# Altium schematic sheet power.SchDoc
size A4
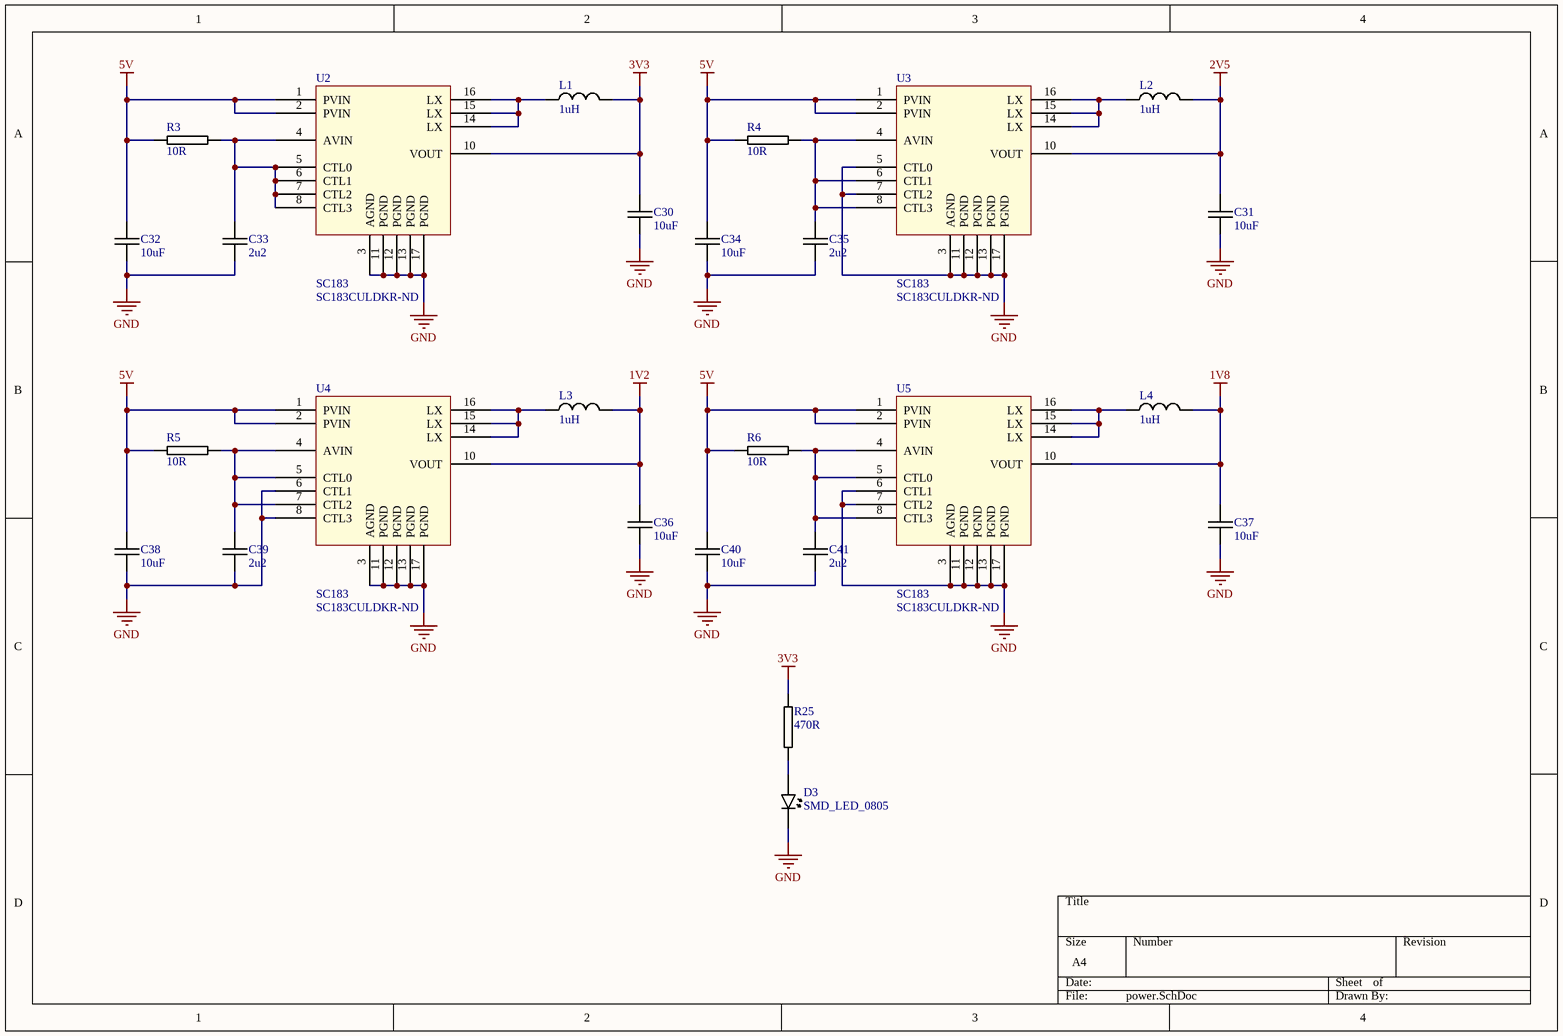
[diagram p0: power.SchDoc]

## Parts
C30  10uF  [0805C-GENERIC]
C31  10uF  [0805C-GENERIC]
C32  10uF  [0805C-GENERIC]
C33  2u2  [0805C-GENERIC]
C34  10uF  [0805C-GENERIC]
C35  2u2  [0805C-GENERIC]
C36  10uF  [0805C-GENERIC]
C37  10uF  [0805C-GENERIC]
C38  10uF  [0805C-GENERIC]
C39  2u2  [0805C-GENERIC]
C40  10uF  [0805C-GENERIC]
C41  2u2  [0805C-GENERIC]
D3  SMD_LED_0805  [CD2012-0805]
L1  1uH  [VISHAY-IHLP1616-GENERIC]
L2  1uH  [VISHAY-IHLP1616-GENERIC]
L3  1uH  [VISHAY-IHLP1616-GENERIC]
L4  1uH  [VISHAY-IHLP1616-GENERIC]
R3  10R  [0603R-10]
R4  10R  [0603R-10]
R5  10R  [0603R-10]
R6  10R  [0603R-10]
R25  470R  [0603R-470]
U2  SC183  Supplier Part Number 1: SC183CULDKR-ND  [QFN50P300X300-16V6N]
U3  SC183  Supplier Part Number 1: SC183CULDKR-ND  [QFN50P300X300-16V6N]
U4  SC183  Supplier Part Number 1: SC183CULDKR-ND  [QFN50P300X300-16V6N]
U5  SC183  Supplier Part Number 1: SC183CULDKR-ND  [QFN50P300X300-16V6N]

## Nets
1V2: C36.1 L3.2 U4.10(VOUT)
1V8: C37.1 L4.2 U5.10(VOUT)
2V5: C31.1 L2.2 U3.10(VOUT)
3V3: C30.1 L1.2 R25.1 U2.10(VOUT)
5V: C32.1 C34.1 C38.1 C40.1 R3.1 R4.1 R5.1 R6.1 U2.1(PVIN) U2.2(PVIN) U3.1(PVIN) U3.2(PVIN) U4.1(PVIN) U4.2(PVIN) U5.1(PVIN) U5.2(PVIN)
GND: C30.2 C31.2 C32.2 C33.2 C34.2 C35.2 C36.2 C37.2 C38.2 C39.2 C40.2 C41.2 D3.2(K) U2.3(AGND) U2.11(PGND) U2.12(PGND) U2.13(PGND) U2.17(PGND) U3.3(AGND) U3.5(CTL0) U3.7(CTL2) U3.11(PGND) U3.12(PGND) U3.13(PGND) U3.17(PGND) U4.3(AGND) U4.6(CTL1) U4.8(CTL3) U4.11(PGND) U4.12(PGND) U4.13(PGND) U4.17(PGND) U5.3(AGND) U5.6(CTL1) U5.7(CTL2) U5.11(PGND) U5.12(PGND) U5.13(PGND) U5.17(PGND)
NetC33_1: C33.1 R3.2 U2.4(AVIN) U2.5(CTL0) U2.6(CTL1) U2.7(CTL2) U2.8(CTL3)
NetC35_1: C35.1 R4.2 U3.4(AVIN) U3.6(CTL1) U3.8(CTL3)
NetC39_1: C39.1 R5.2 U4.4(AVIN) U4.5(CTL0) U4.7(CTL2)
NetC41_1: C41.1 R6.2 U5.4(AVIN) U5.5(CTL0) U5.8(CTL3)
NetD3_1: D3.1(A) R25.2
NetL1_1: L1.1 U2.14(LX) U2.15(LX) U2.16(LX)
NetL2_1: L2.1 U3.14(LX) U3.15(LX) U3.16(LX)
NetL3_1: L3.1 U4.14(LX) U4.15(LX) U4.16(LX)
NetL4_1: L4.1 U5.14(LX) U5.15(LX) U5.16(LX)

## Library data of the parts
C30-C32 C34 C36-C38 C40 = 0805C-10UF-16V-X5R-TDK: CAPACITOR 0805 CERAMIC; Manufacturer Part Number: C2012X5R1C106M; Manufacturer: TDK Corporation; REEL: C63; Description: CAP CER 10UF 16V X5R 0805; Supplier 1: Digi-Key; Supplier Part Number 1: 445-4115-2-ND
C33 C35 C39 C41 = 0805C-2U2-6V3-X5R-PAN: CAPACITOR 0805 CERAMIC; Manufacturer Part Number: ECJ-1VB0J225K; Manufacturer: Panasonic - ECG; Description: CAP 2.2UF 6.3V CERAMIC X5R 0603; Reel: C7; Supplier 1: Digi-Key; Supplier Part Number 1: PCC2273TR-ND
L1-L4 = 1U-IHLP1616-VISHAY: Manufacturer Part Number: IHLP1616ABER1R0M01; Manufacturer: Vishay/Dale; Reel: L8; Description: INDUCTOR POWER 1.0UH 4.0A SMD; Supplier 1: Digi-Key; Supplier Part Number 1: 541-1043-2-ND
R3-R6 = 0603R-10R: GENERIC RESISTOR 0603; Manufacturer Part Number: RMCF 1/16 10 1% R; Manufacturer: Stackpole Electronics Inc; Description: RES 10 OHM 1/10W 1% 0603 SMD; Resistance In Ohms: 10.0; Tolerance: ±1%; Temperature Coefficient: ±100ppm/°C; Power (Watts): 0.1W, 1/10W; Reel: *; Supplier: Digi-Key; Supplier Part Number: RMCF1/1610FRDKR-ND; Composition: Thick Film; RoHS: RoHS Compliant; Category: Resistors; Lead Style: Surface Mount (SMD - SMT); Packaging: Digi-Reel®; Case: 0603 (1608 metric); Supplier 1: Digi-Key; Supplier Part Number 1: RMCF1/1610FRDKR-ND
R25 = 0603R-470: GENERIC RESISTOR 0603; Manufacturer Part Number: RMCF 1/16 470 1% R; Manufacturer: Stackpole Electronics Inc; Tolerance: ±1%; Power (Watts): 0.1W, 1/10W; Temperature Coefficient: ±100ppm/°C; Resistance In Ohms: 470; Description: RES 470 OHM 1/10W 1% 0603 SMD; Reel: R17; Supplier 1: Digi-Key; Supplier Part Number 1: RMCF1/16470FRTR-ND; Supplier: Digi-Key; Composition: Thick Film; Packaging: Tape & Reel (TR); Lead Style: Surface Mount (SMD - SMT); Category: Resistors; RoHS: RoHS Compliant; Supplier Part Number: RMCF1/16470FRTR-ND; Case: 0603 (1608 metric)
U2-U5 = SC183: Supplier 1: Digi-Key